# EAGLE design Mega68K (EAGLE 9.6.2)
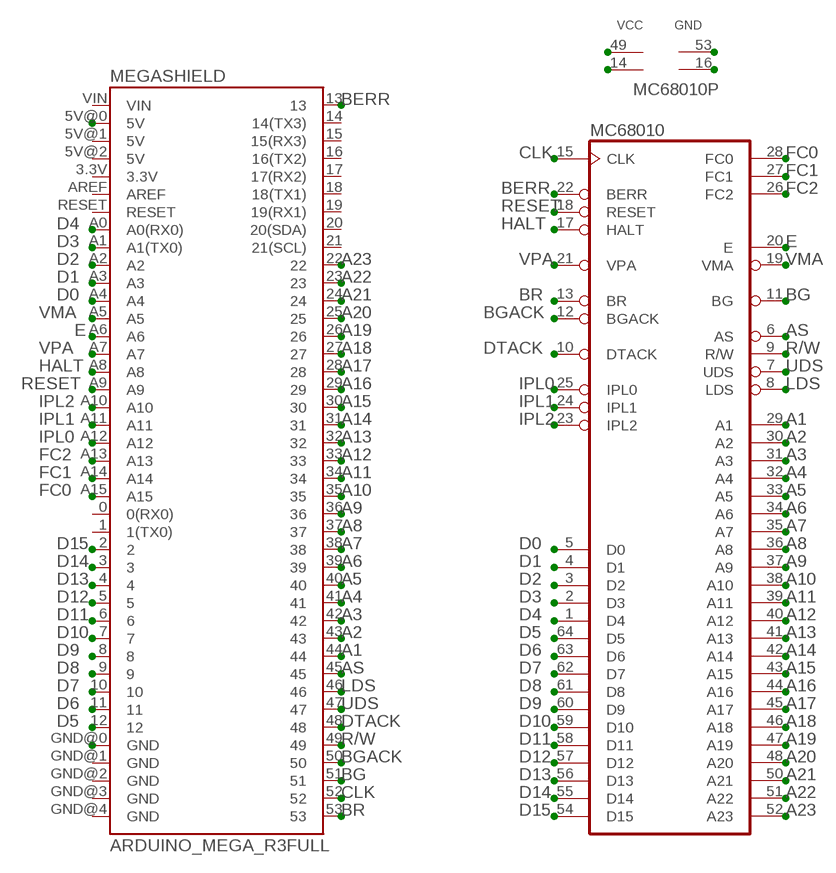
[diagram p0: schematic, sheet 1]

## Parts
MC68010  MC68000P  [DIL64]
MEGASHIELD  ARDUINO_MEGA_R3FULL  [ARDUINO_MEGA]

## Nets
A1: MC68010.29(A1) MEGASHIELD.44
A2: MC68010.30(A2) MEGASHIELD.43
A3: MC68010.31(A3) MEGASHIELD.42
A4: MC68010.32(A4) MEGASHIELD.41
A5: MC68010.33(A5) MEGASHIELD.40
A6: MC68010.34(A6) MEGASHIELD.39
A7: MC68010.35(A7) MEGASHIELD.38
A8: MC68010.36(A8) MEGASHIELD.37
A9: MC68010.37(A9) MEGASHIELD.36
A10: MC68010.38(A10) MEGASHIELD.35
A11: MC68010.39(A11) MEGASHIELD.34
A12: MC68010.40(A12) MEGASHIELD.33
A13: MC68010.41(A13) MEGASHIELD.32
A14: MC68010.42(A14) MEGASHIELD.31
A15: MC68010.43(A15) MEGASHIELD.30
A16: MC68010.44(A16) MEGASHIELD.29
A17: MC68010.45(A17) MEGASHIELD.28
A18: MC68010.46(A18) MEGASHIELD.27
A19: MC68010.47(A19) MEGASHIELD.26
A20: MC68010.48(A20) MEGASHIELD.25
A21: MC68010.50(A21) MEGASHIELD.24
A22: MC68010.51(A22) MEGASHIELD.23
A23: MC68010.52(A23) MEGASHIELD.22
AS: MC68010.6(AS) MEGASHIELD.45
BERR: MC68010.22(BERR) MEGASHIELD.13
BG: MC68010.11(BG) MEGASHIELD.51
BGACK: MC68010.12(BGACK) MEGASHIELD.50
BR: MC68010.13(BR) MEGASHIELD.53
CLK: MC68010.15(CLK) MEGASHIELD.52
D0: MC68010.5(D0) MEGASHIELD.A4
D1: MC68010.4(D1) MEGASHIELD.A3
D2: MC68010.3(D2) MEGASHIELD.A2
D3: MC68010.2(D3) MEGASHIELD.A1(A1(TX0))
D4: MC68010.1(D4) MEGASHIELD.A0(A0(RX0))
D5: MC68010.64(D5) MEGASHIELD.12
D6: MC68010.63(D6) MEGASHIELD.11
D7: MC68010.62(D7) MEGASHIELD.10
D8: MC68010.61(D8) MEGASHIELD.9
D9: MC68010.60(D9) MEGASHIELD.8
D10: MC68010.59(D10) MEGASHIELD.7
D11: MC68010.58(D11) MEGASHIELD.6
D12: MC68010.57(D12) MEGASHIELD.5
D13: MC68010.56(D13) MEGASHIELD.4
D14: MC68010.55(D14) MEGASHIELD.3
D15: MC68010.54(D15) MEGASHIELD.2
DTACK: MC68010.10(DTACK) MEGASHIELD.48
E: MC68010.20(E) MEGASHIELD.A6
FC0: MC68010.28(FC0) MEGASHIELD.A15
FC1: MC68010.27(FC1) MEGASHIELD.A14
FC2: MC68010.26(FC2) MEGASHIELD.A13
GND: MC68010.16(GND) MC68010.53(GND) MEGASHIELD.GND@0(GND)
HALT: MC68010.17(HALT) MEGASHIELD.A8
IPL0: MC68010.25(IPL0) MEGASHIELD.A12
IPL1: MC68010.24(IPL1) MEGASHIELD.A11
IPL2: MC68010.23(IPL2) MEGASHIELD.A10
LDS: MC68010.8(LDS) MEGASHIELD.46
R/W: MC68010.9(R/W) MEGASHIELD.49
RESET: MC68010.18(RESET) MEGASHIELD.A9
UDS: MC68010.7(UDS) MEGASHIELD.47
VCC: MC68010.14(VCC) MC68010.49(VCC) MEGASHIELD.5V@0(5V)
VMA: MC68010.19(VMA) MEGASHIELD.A5
VPA: MC68010.21(VPA) MEGASHIELD.A7
Unconnected: MEGASHIELD.0(0(RX0)) MEGASHIELD.1(1(TX0)) MEGASHIELD.3.3V MEGASHIELD.5V@1(5V) MEGASHIELD.5V@2(5V) MEGASHIELD.14(14(TX3)) MEGASHIELD.15(15(RX3)) MEGASHIELD.16(16(TX2)) MEGASHIELD.17(17(RX2)) MEGASHIELD.18(18(TX1)) MEGASHIELD.19(19(RX1)) MEGASHIELD.20(20(SDA)) MEGASHIELD.21(21(SCL)) MEGASHIELD.AREF MEGASHIELD.GND@1(GND) MEGASHIELD.GND@2(GND) MEGASHIELD.GND@3(GND) MEGASHIELD.GND@4(GND) MEGASHIELD.RESET MEGASHIELD.VIN

## Library data of the parts
MC68010 = micro-mc68000:MC68000P: 68xxx PROCESSOR; OC_FARNELL: unknown; OC_NEWARK: unknown
MEGASHIELD = MEGA Shield:ARDUINO_MEGA_R3: Arduino Mega R3 ATmega2560 R3 compatible footprint. SparkFun Products: Arduino Mega 2560 R3 <https://www.sparkfun.com/products/11061>

## Board
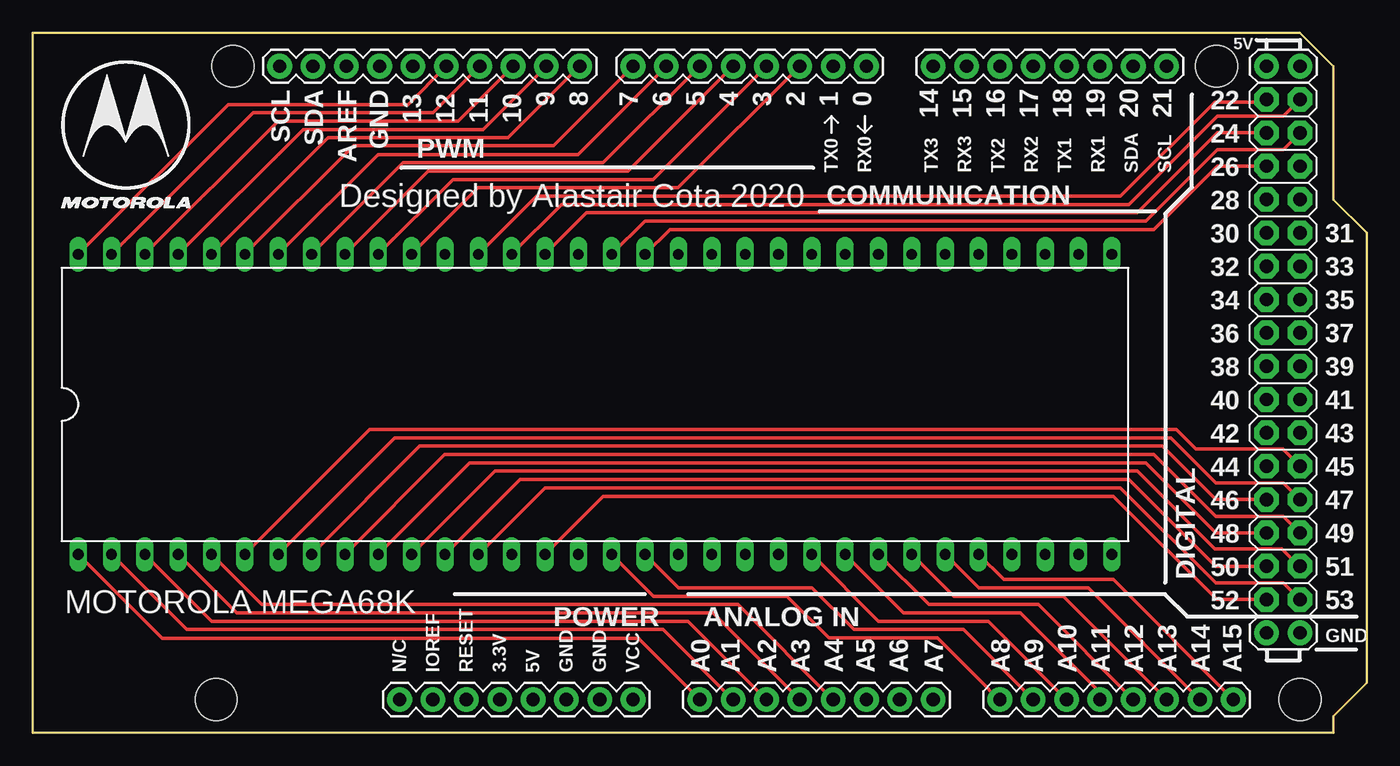
[diagram p1: board, top side]
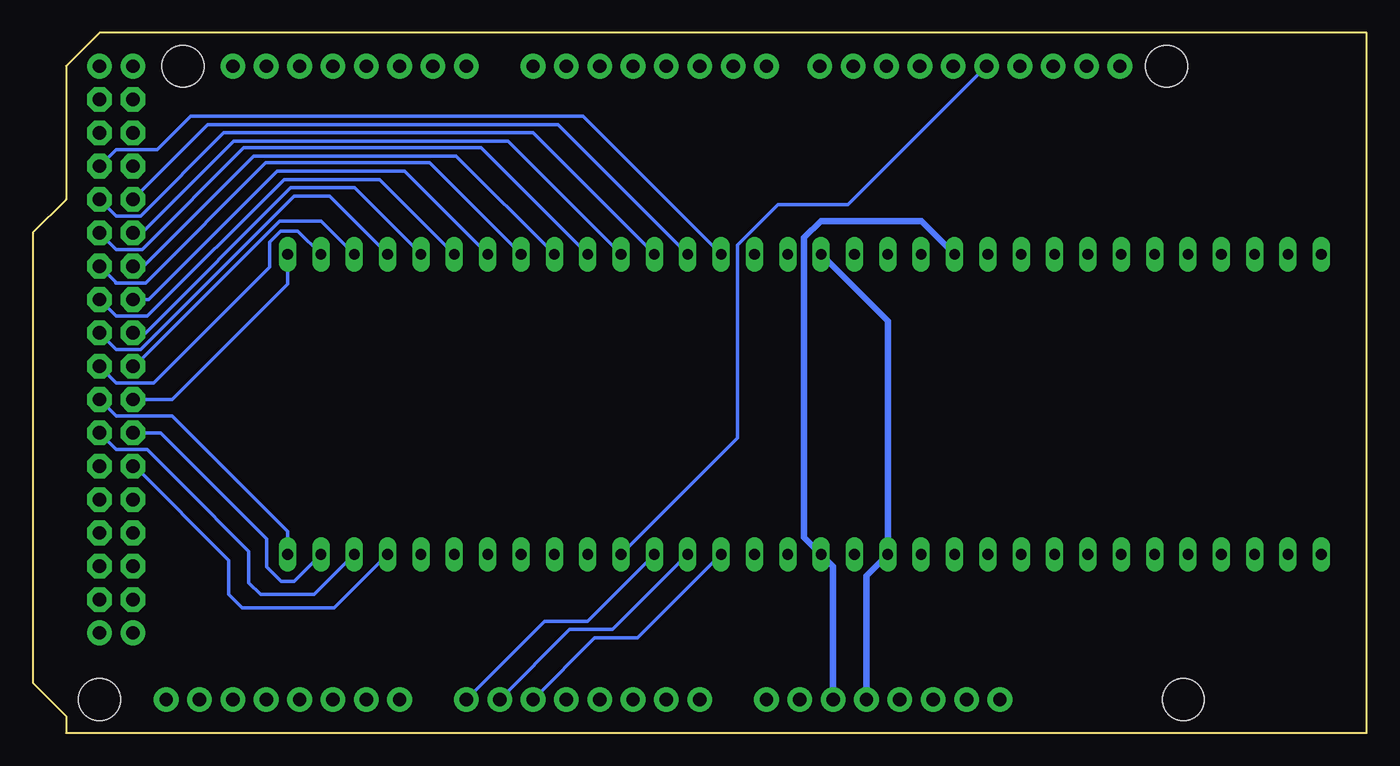
[diagram p2: board, bottom side, seen from below]

Size 101.6 x 53.34 mm. Coordinates in mm from the lower left corner, seen from the top.
Outline: 0,53.34 96.52,53.34 99.06,50.8 99.06,40.64 101.6,38.1 101.6,3.81 99.06,1.27 99.06,0 0,0 0,53.34
Copper layers (1*16): Top 0.035mm / dielectric 1.5mm / Bottom 0.035mm
Design rules "default": minimum track width 6mil, minimum drill 0.35mm, track to track 6mil, track to pad 6mil, pad to pad 6mil, via to via 6mil, smd to smd 6mil, copper to edge 40mil, drill to drill 6mil, minimum pad ring 10mil, minimum via ring 8mil, stop-mask expansion 4mil, vias tented up to drill 0mil, thermal gap 10mil

### Footprints (pad centres in the part's own frame; a part is rotated, then mirrored left to right if it is on the bottom)
DIL64 = drill 0.813 long: 1 -39.37,-11.43; 2 -36.83,-11.43; 3 -34.29,-11.43; 4 -31.75,-11.43; 5 -29.21,-11.43; 6 -26.67,-11.43; 7 -24.13,-11.43; 8 -21.59,-11.43; 9 -19.05,-11.43; 10 -16.51,-11.43; 11 -13.97,-11.43; 12 -11.43,-11.43; 13 -8.89,-11.43; 14 -6.35,-11.43; 15 -3.81,-11.43; 16 -1.27,-11.43; 17 1.27,-11.43; 18 3.81,-11.43; 19 6.35,-11.43; 20 8.89,-11.43; 21 11.43,-11.43; 22 13.97,-11.43; 23 16.51,-11.43; 24 19.05,-11.43; 25 21.59,-11.43; 26 24.13,-11.43; 27 26.67,-11.43; 28 29.21,-11.43; 29 31.75,-11.43; 30 34.29,-11.43; 31 36.83,-11.43; 32 39.37,-11.43; 33 39.37,11.43; 34 36.83,11.43; 35 34.29,11.43; 36 31.75,11.43; 37 29.21,11.43; 38 26.67,11.43; 39 24.13,11.43; 40 21.59,11.43; 41 19.05,11.43; 42 16.51,11.43; 43 13.97,11.43; 44 11.43,11.43; 45 8.89,11.43; 46 6.35,11.43; 47 3.81,11.43; 48 1.27,11.43; 49 -1.27,11.43; 50 -3.81,11.43; 51 -6.35,11.43; 52 -8.89,11.43; 53 -11.43,11.43; 54 -13.97,11.43; 55 -16.51,11.43; 56 -19.05,11.43; 57 -21.59,11.43; 58 -24.13,11.43; 59 -26.67,11.43; 60 -29.21,11.43; 61 -31.75,11.43; 62 -34.29,11.43; 63 -36.83,11.43; 64 -39.37,11.43
ARDUINO_MEGA = drill 1.016 pad 1.88: 0 13.97,24.13; 1 11.43,24.13; 2 8.89,24.13; 3 6.35,24.13; 3.3V -13.97,-24.13; 4 3.81,24.13; 5 1.27,24.13; 5V@0 -11.43,-24.13; 5V@1 44.45,24.13; 5V@2 46.99,24.13; 6 -1.27,24.13; 7 -3.81,24.13; 8 -7.874,24.13; 9 -10.414,24.13; 10 -12.954,24.13; 11 -15.494,24.13; 12 -18.034,24.13; 13 -20.574,24.13; 14 19.05,24.13; 15 21.59,24.13; 16 24.13,24.13; 17 26.67,24.13; 18 29.21,24.13; 19 31.75,24.13; 20 34.29,24.13; 21 36.83,24.13; A0 1.27,-24.13; A1 3.81,-24.13; A2 6.35,-24.13; A3 8.89,-24.13; A4 11.43,-24.13; A5 13.97,-24.13; A6 16.51,-24.13; A7 19.05,-24.13; A8 24.13,-24.13; A9 26.67,-24.13; A10 29.21,-24.13; A11 31.75,-24.13; A12 34.29,-24.13; A13 36.83,-24.13; A14 39.37,-24.13; A15 41.91,-24.13; AREF -25.654,24.13; BLANK -21.59,-24.13; GND@0 -8.89,-24.13; GND@1 -6.35,-24.13; GND@2 44.45,-19.05; GND@3 46.99,-19.05; GND@4 -23.114,24.13; IOREF -19.05,-24.13; RESET -16.51,-24.13; SCL -30.734,24.13; SDA -28.194,24.13; VIN -3.81,-24.13 | drill 1.016 pad 1.88 octagon: 22 44.45,21.59; 23 46.99,21.59; 24 44.45,19.05; 25 46.99,19.05; 26 44.45,16.51; 27 46.99,16.51; 28 44.45,13.97; 29 46.99,13.97; 30 44.45,11.43; 31 46.99,11.43; 32 44.45,8.89; 33 46.99,8.89; 34 44.45,6.35; 35 46.99,6.35; 36 44.45,3.81; 37 46.99,3.81; 38 44.45,1.27; 39 46.99,1.27; 40 44.45,-1.27; 41 46.99,-1.27; 42 44.45,-3.81; 43 46.99,-3.81; 44 44.45,-6.35; 45 46.99,-6.35; 46 44.45,-8.89; 47 46.99,-8.89; 48 44.45,-11.43; 49 46.99,-11.43; 50 44.45,-13.97; 51 46.99,-13.97; 52 44.45,-16.51; 53 46.99,-16.51 | hole 3.2: -34.29,24.13; -35.56,-24.13; 40.64,24.13; 46.99,-24.13

### Placement (x,y rotation side)
MC68010  42.82,25.03 0 top
MEGASHIELD  49.53,26.67 0 top

### Tracks (layer width: path | path; a pad name or v marks a point on that pad's centre or on a via)
A1
  Bottom 0.254: MEGASHIELD.44 93.85,20.32 86.66,13.13 86.66,10.54 85.65,9.53 78.65,9.53 MC68010.29
A2
  Bottom 0.254: MEGASHIELD.43 95.25,21.59 92.89,21.59 90.22,18.92 85.14,13.84 85.14,11.43 84.25,10.54 80.17,10.54 MC68010.30
A3
  Bottom 0.254: MC68010.31 81.7,11.56 82.68,11.56 83.78,12.66 83.78,14.77 91.87,22.86 MEGASHIELD.42
A4
  Bottom 0.254: MEGASHIELD.41 95.25,24.13 90.98,24.13 82.19,15.34 MC68010.32
A5
  Bottom 0.254: MC68010.33 82.19,34.19 90.98,25.4 MEGASHIELD.40
A6
  Bottom 0.254: MC68010.34 81.42,38.23 82.73,38.23 83.55,37.4 83.55,35.5 92.38,26.67 95.25,26.67 MEGASHIELD.39
A7
  Bottom 0.254: MC68010.35 79.64,38.99 82.8,38.99 93.85,27.94 MEGASHIELD.38
A8
  Bottom 0.254: MC68010.36 79.01,40.89 81.71,40.89 93.4,29.21 95.25,29.21 MEGASHIELD.37
A9
  Bottom 0.254: MC68010.37 77.1,41.53 81.97,41.53 93.01,30.48 MEGASHIELD.36
A10
  Bottom 0.254: MC68010.38 75.2,42.16 82.47,42.16 92.89,31.75 95.25,31.75 MEGASHIELD.35
A11
  Bottom 0.254: MEGASHIELD.34 92.76,33.02 82.98,42.8 73.29,42.8 MC68010.39
A12
  Bottom 0.254: MEGASHIELD.33 95.3,34.34 95.3,34.29 93.01,34.29 83.87,43.43 71.39,43.43 MC68010.40
A13
  Bottom 0.254: MEGASHIELD.32 93.14,35.56 84.76,43.94 69.35,43.94 MC68010.41
A14
  Bottom 0.254: MEGASHIELD.31 95.25,36.83 93.27,36.83 85.52,44.58 67.45,44.58 MC68010.42
A15
  Bottom 0.254: MEGASHIELD.30 93.27,38.1 86.28,45.09 65.42,45.09 MC68010.43
A16
  Bottom 0.254: MEGASHIELD.29 95.25,39.37 93.4,39.37 87.05,45.72 63.51,45.72 MC68010.44
A17
  Bottom 0.254: MEGASHIELD.28 88.26,46.36 61.61,46.36 MC68010.45
A18
  Bottom 0.254: MEGASHIELD.27 95.25,44.45 92.13,44.45 89.59,46.99 59.7,46.99 MC68010.46
A19
  Top 0.254: MEGASHIELD.26 90.22,43.18 85.39,38.35 48.53,38.35 MC68010.47
A20
  Top 0.254: MC68010.48 46.62,38.99 84.76,38.99 90.22,44.45 95.25,44.45 MEGASHIELD.25
A21
  Top 0.254: MC68010.50 42.18,39.62 84.12,39.62 90.22,45.72 MEGASHIELD.24
A22
  Top 0.254: MC68010.51 40.27,40.26 83.49,40.26 89.8,46.57 89.84,46.61 90.23,47 93.33,47 95.26,47 MEGASHIELD.23
A23
  Top 0.254: MC68010.52 38.37,40.89 82.85,40.89 90.02,48.06 93.78,48.06 MEGASHIELD.22
AS
  Top 0.254: MC68010.6 25.67,23.11 87.1,23.11 88.57,21.64 95.2,21.64 MEGASHIELD.45
BERR
  Bottom 0.254: MEGASHIELD.13 39.5,40.26 44.83,40.26 47.93,37.16 47.93,22.47 MC68010.22
BG
  Top 0.254: MC68010.11 35.19,19.94 84.12,19.94 90.04,14.02 95.12,14.02 96.44,12.7 MEGASHIELD.51
BGACK
  Top 0.254: MC68010.12 37.1,19.3 83.49,19.3 90.09,12.7 MEGASHIELD.50
BR
  Top 0.254: MC68010.13 39,18.67 82.85,18.67 90.09,11.43 95.25,11.43 MEGASHIELD.53
CLK
  Top 0.254: MC68010.15 43.45,18.03 82.3,18.03 90.17,10.16 MEGASHIELD.52
D0
  Top 0.254: MC68010.5 17.44,9.78 53.72,9.78 MEGASHIELD.A4
D1
  Top 0.254: MEGASHIELD.A3 51.82,9.14 15.53,9.14 MC68010.4
D2
  Top 0.254: MC68010.3 13.63,8.51 49.91,8.51 MEGASHIELD.A2
D3
  Top 0.254: MEGASHIELD.A1 48.01,7.87 11.72,7.87 MC68010.2
D4
  Top 0.254: MC68010.1 9.87,7.19 46.15,7.19 MEGASHIELD.A0
D5
  Top 0.254: MC68010.64 14.87,47.88 28.57,47.88 MEGASHIELD.12
D6
  Top 0.254: MC68010.63 16.78,47.24 30.48,47.24 MEGASHIELD.11
D7
  Top 0.254: MC68010.62 18.68,46.61 32.38,46.61 MEGASHIELD.10
D8
  Top 0.254: MC68010.61 20.59,45.97 34.29,45.97 MEGASHIELD.9
D9
  Top 0.254: MC68010.60 22.49,45.34 36.19,45.34 MEGASHIELD.8
D10
  Top 0.254: MEGASHIELD.7 39.65,44.73 24.42,44.73 MC68010.59
D11
  Top 0.254: MEGASHIELD.6 41.53,44.07 26.3,44.07 MC68010.58
D12
  Top 0.254: MEGASHIELD.5 43.43,43.43 28.21,43.43 MC68010.57
D13
  Top 0.254: MC68010.56 30.11,42.8 45.34,42.8 MEGASHIELD.4
D14
  Top 0.254: MEGASHIELD.3 47.24,42.16 32.02,42.16 MC68010.55
D15
  Top 0.254: MC68010.54 33.92,41.53 49.15,41.53 MEGASHIELD.2
DTACK
  Top 0.254: MC68010.10 33.29,20.57 84.76,20.57 90.09,15.24 MEGASHIELD.48
E
  Bottom 0.254: MC68010.20 57.44,7.87 60.71,7.87 MEGASHIELD.A6
FC0
  Top 0.254: MEGASHIELD.A15 82.3,11.68 73.95,11.68 MC68010.28
FC1
  Top 0.254: MC68010.27 72.05,11.05 80.39,11.05 MEGASHIELD.A14
FC2
  Top 0.254: MEGASHIELD.A13 78.49,10.41 70.14,10.41 MC68010.26
GND
  Bottom 0.508: MEGASHIELD.GND@0 40.64,12.69 MC68010.16 42.85,14.9 42.85,37.72 41.58,38.99 33.92,38.99 MC68010.53
HALT
  Top 0.254: MC68010.17 47.28,10.41 57.45,10.41 60.63,7.24 68.88,7.24 70.6,5.52 72.06,4.06 73.58,2.54 MEGASHIELD.A8
IPL0
  Top 0.254: MEGASHIELD.A12 76.58,9.78 68.24,9.78 MC68010.25
IPL1
  Top 0.254: MC68010.24 66.33,9.14 75.23,9.14 81.28,3.1 MEGASHIELD.A11
IPL2
  Top 0.254: MEGASHIELD.A10 72.77,8.51 64.43,8.51 MC68010.23
LDS
  Top 0.254: MC68010.8 29.48,21.84 86.03,21.84 90.09,17.78 MEGASHIELD.46
R/W
  Top 0.254: MC68010.9 31.38,21.21 85.39,21.21 90.09,16.51 95.25,16.51 MEGASHIELD.49
RESET
  Top 0.254: MC68010.18 49.19,11.05 59.36,11.05 62.53,7.87 70.41,7.87 70.87,7.87 MEGASHIELD.A9
UDS
  Top 0.254: MC68010.7 27.57,22.48 86.66,22.48 90.09,19.05 95.25,19.05 MEGASHIELD.47
VCC
  Bottom 0.508: MEGASHIELD.5V@0 38.1,11.98 MC68010.14 36.47,31.38 MC68010.49
VMA
  Bottom 0.254: MEGASHIELD.A5 58.8,7.24 55.54,7.24 MC68010.19
VPA
  Bottom 0.254: MEGASHIELD.A7 62.61,8.51 59.35,8.51 MC68010.21

### Text on the board
tNames: Designed by Alastair Cota 2020 | MOTOROLA MEGA68K